# EAGLE design buffered multiple (EAGLE 7.7.0)
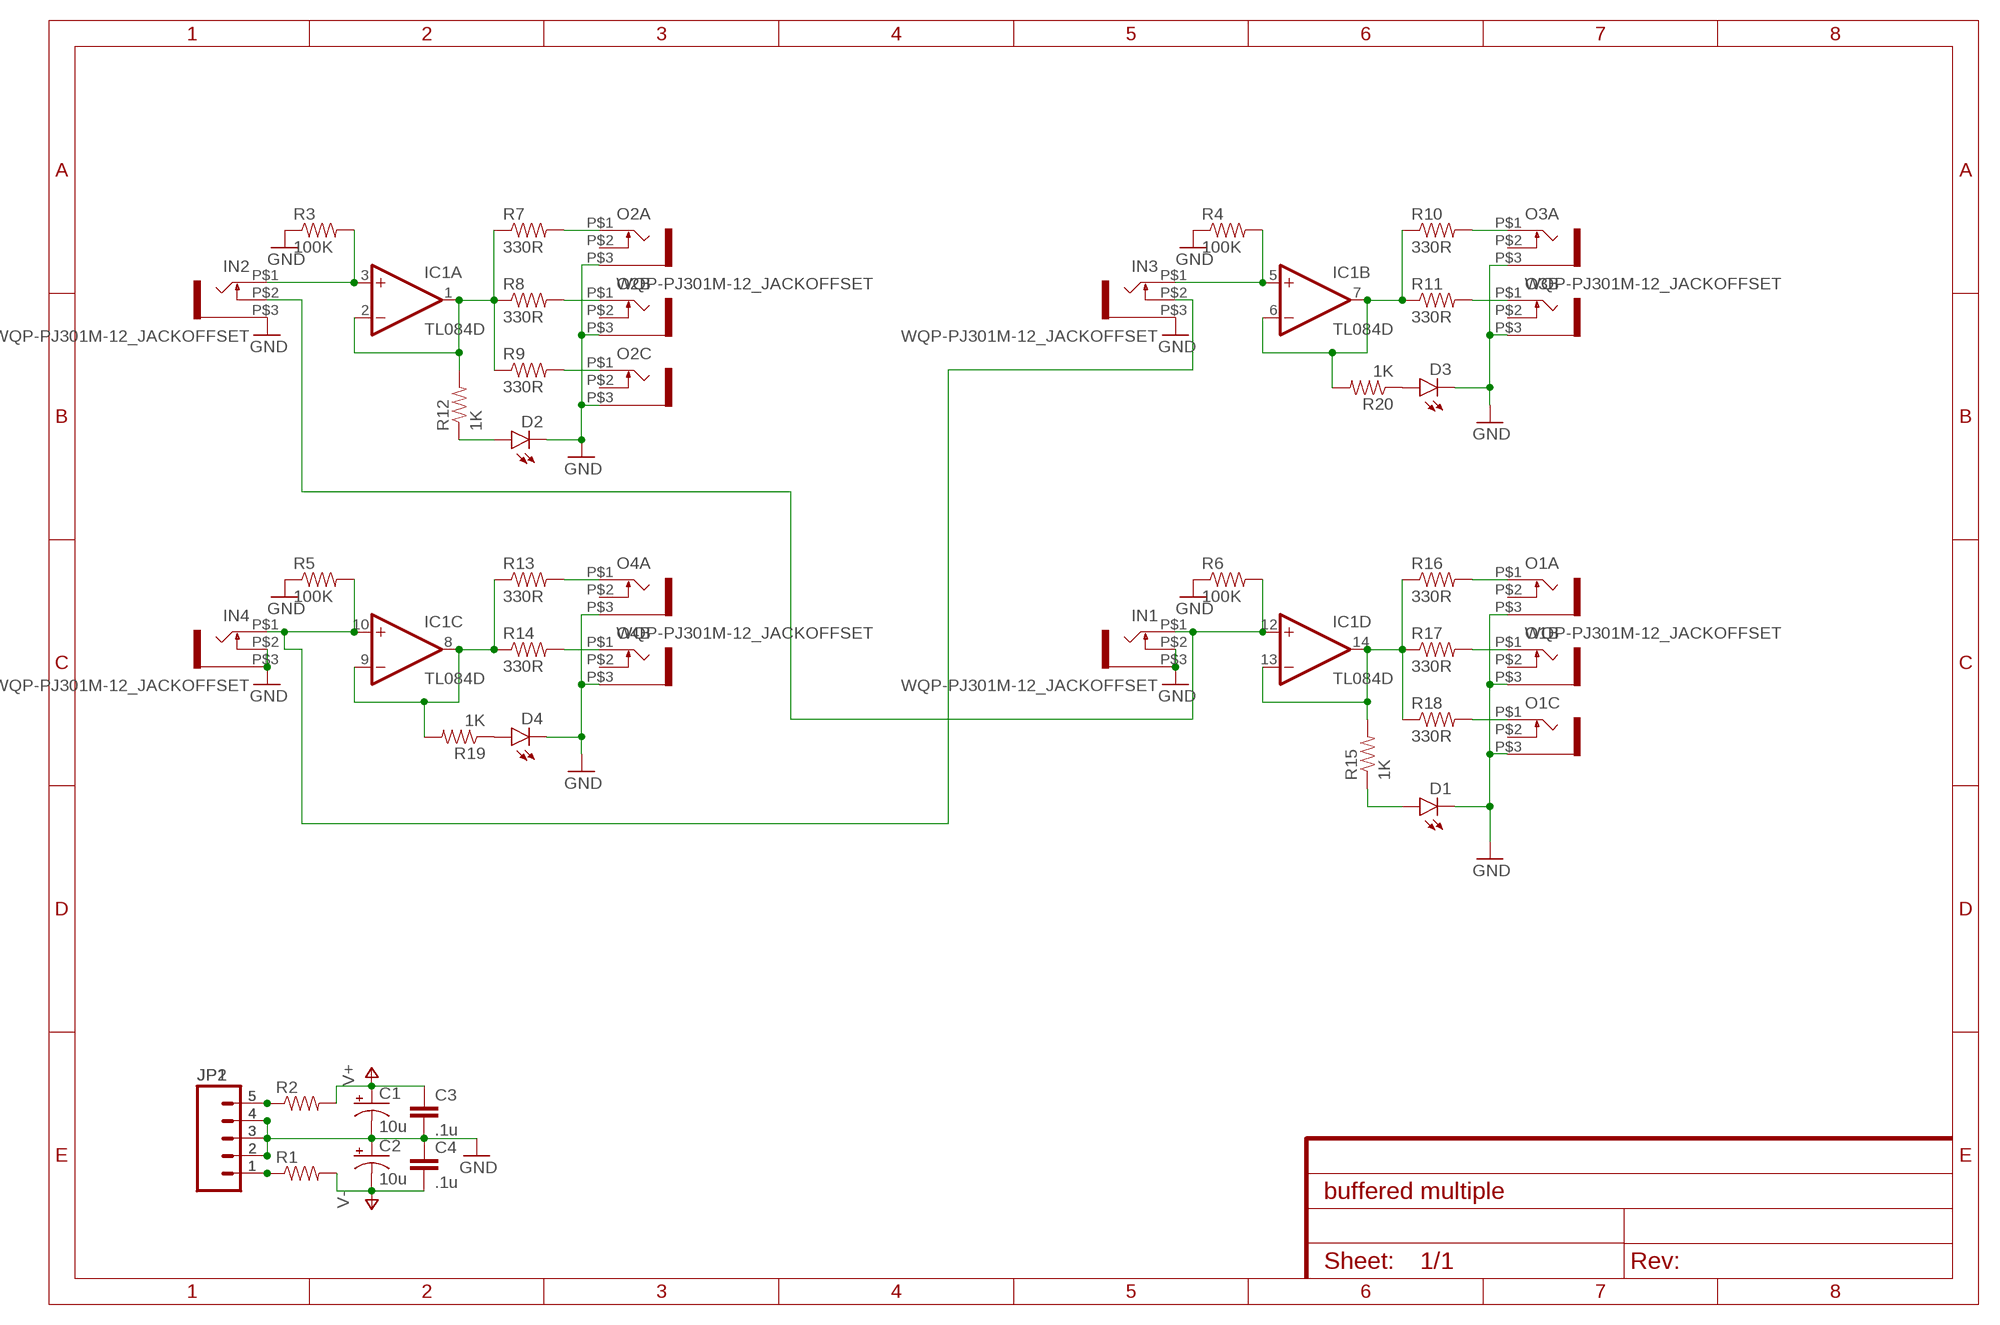
[diagram p0: schematic, sheet 1]

## Parts
C1  10u  CAP_POL1206-KIT  [EIA3216-KIT]
C2  10u  CAP_POL1206-KIT  [EIA3216-KIT]
C3  .1u  CAP0805  [0805]
C4  .1u  CAP0805  [0805]
D1  LED3MM  [LED3MM]
D2  LED3MM  [LED3MM]
D3  LED3MM  [LED3MM]
D4  LED3MM  [LED3MM]
IC1  TL084D  [SO14]
IN1  WQP-PJ301M-12_JACKOFFSET  [WQP-PJ301M-12_JACKOFFSET]
IN2  WQP-PJ301M-12_JACKOFFSET  [WQP-PJ301M-12_JACKOFFSET]
IN3  WQP-PJ301M-12_JACKOFFSET  [WQP-PJ301M-12_JACKOFFSET]
IN4  WQP-PJ301M-12_JACKOFFSET  [WQP-PJ301M-12_JACKOFFSET]
JP1  M05PTH  [1X05]
JP2  M05PTH  [1X05]
O1A  WQP-PJ301M-12_JACKOFFSET  [WQP-PJ301M-12_JACKOFFSET]
O1B  WQP-PJ301M-12_JACK  [WQP-PJ301M-12_JACK]
O1C  WQP-PJ301M-12_JACK  [WQP-PJ301M-12_JACK]
O2A  WQP-PJ301M-12_JACKOFFSET  [WQP-PJ301M-12_JACKOFFSET]
O2B  WQP-PJ301M-12_JACK  [WQP-PJ301M-12_JACK]
O2C  WQP-PJ301M-12_JACK  [WQP-PJ301M-12_JACK]
O3A  WQP-PJ301M-12_JACKOFFSET  [WQP-PJ301M-12_JACKOFFSET]
O3B  WQP-PJ301M-12_JACK  [WQP-PJ301M-12_JACK]
O4A  WQP-PJ301M-12_JACKOFFSET  [WQP-PJ301M-12_JACKOFFSET]
O4B  WQP-PJ301M-12_JACK  [WQP-PJ301M-12_JACK]
R1  RESISTOR0805-RES  [0805]
R2  RESISTOR0805-RES  [0805]
R3  100K  RESISTOR0805-RES  [0805]
R4  100K  RESISTOR0805-RES  [0805]
R5  100K  RESISTOR0805-RES  [0805]
R6  100K  RESISTOR0805-RES  [0805]
R7  330R  RESISTOR0805-RES  [0805]
R8  330R  RESISTOR0805-RES  [0805]
R9  330R  RESISTOR0805-RES  [0805]
R10  330R  RESISTOR0805-RES  [0805]
R11  330R  RESISTOR0805-RES  [0805]
R12  1K  RESISTOR0805-RES  [0805]
R13  330R  RESISTOR0805-RES  [0805]
R14  330R  RESISTOR0805-RES  [0805]
R15  1K  RESISTOR0805-RES  [0805]
R16  330R  RESISTOR0805-RES  [0805]
R17  330R  RESISTOR0805-RES  [0805]
R18  330R  RESISTOR0805-RES  [0805]
R19  1K  RESISTOR0805-RES  [0805]
R20  1K  RESISTOR0805-RES  [0805]

## Nets
GND: C1.C(-) C2.A(+) C3.2 C4.1 D1.K(C) D2.K(C) D3.K(C) D4.K(C) IN1.P$2 IN1.P$3 IN2.P$3 IN3.P$3 IN4.P$2 IN4.P$3 JP1.2 JP1.3 JP1.4 JP2.2 JP2.3 JP2.4 O1A.P$3 O1B.P$3 O1C.P$3 O2A.P$3 O2B.P$3 O2C.P$3 O3A.P$3 O3B.P$3 O4A.P$3 O4B.P$3 R3.1 R4.1 R5.1 R6.1
N$1: JP1.1 JP2.1 R1.1
N$2: JP1.5 JP2.5 R2.1
N$3: IC1.12(D:+IN) IN1.P$1 IN2.P$2 R6.2
N$4: IC1.10(C:+IN) IN3.P$2 IN4.P$1 R5.2
N$5: IC1.3(A:+IN) IN2.P$1 R3.2
N$6: IC1.5(B:+IN) IN3.P$1 R4.2
N$11: IC1.1(A:OUT) IC1.2(A:-IN) R7.1 R8.1 R9.1 R12.2
N$12: O2A.P$1 R7.2
N$13: O2B.P$1 R8.2
N$14: O2C.P$1 R9.2
N$16: IC1.8(C:OUT) IC1.9(C:-IN) R13.1 R14.1 R19.2
N$17: O4A.P$1 R13.2
N$18: O4B.P$1 R14.2
N$20: IC1.6(B:-IN) IC1.7(B:OUT) R10.1 R11.1 R20.2
N$21: O3A.P$1 R10.2
N$22: O3B.P$1 R11.2
N$23: D4.A R19.1
N$24: IC1.13(D:-IN) IC1.14(D:OUT) R15.2 R16.1 R17.1 R18.1
N$25: O1A.P$1 R16.2
N$26: O1B.P$1 R17.2
N$27: O1C.P$1 R18.2
N$28: D3.A R20.1
N$29: D1.A R15.1
N$30: D2.A R12.1
V+: C1.A(+) C3.1 R2.2
V-: C2.C(-) C4.2 R1.2
Unconnected: O1A.P$2 O1B.P$2 O1C.P$2 O2A.P$2 O2B.P$2 O2C.P$2 O3A.P$2 O3B.P$2 O4A.P$2 O4B.P$2

## Power pins joined to a net without a drawn wire
V+: IC1.4(P:V+)
V-: IC1.11(P:V-)

## Library data of the parts
C1 C2 = SparkFun-Capacitors:CAP_POL: Capacitor Polarized These are standard SMD and PTH capacitors. Normally 10uF, 47uF, and 100uF in electrolytic and tantalum varieties. Always verify the external diameter of the through hole cap, it varies with capacity, voltage, and manufacturer. The EIA devices should be standard.
C3 C4 = SparkFun-Passives:CAP: Capacitor Standard 0603 ceramic capacitor, and 0.1" leaded capacitor.
D1-D4 = SparkFun-LED:LED: LEDs Standard schematic elements and footprints for 5mm, 3mm, 1206, and 0603 sized LEDs. 5mm - Spark Fun Electronics SKU : COM-00529 (and others)
IC1 = linear:TL084: OP AMP
IN1-IN4 O1A O2A O3A O4A = thonkiconn:WQP-PJ301M-12_JACKOFFSET
JP1 JP2 = SparkFun-Connectors:M05: Header 5 Standard 5-pin 0.1" header. Use with straight break away headers (SKU : PRT-00116), right angle break away headers (PRT-00553), swiss pins (PRT-00743), machine pins (PRT-00117), and female headers (PRT-00115). Molex polarized connector foot print use with SKU : PRT-08230 with associated crimp pins and housings.
O1B O1C O2B O2C O3B O4B = thonkiconn:WQP-PJ301M-12_JACK
R1-R20 = SparkFun-Passives:RESISTOR: Resistor Basic schematic elements and footprints for 0603, 1206, and PTH resistors.

## Board
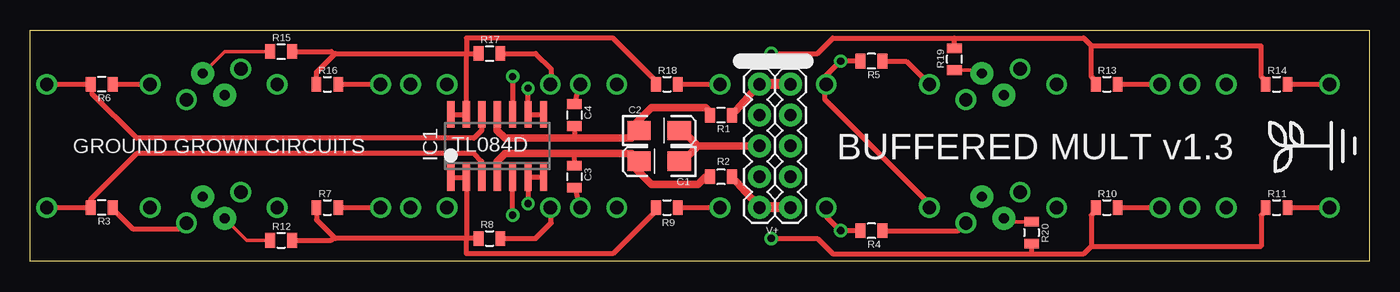
[diagram p1: board, top side]
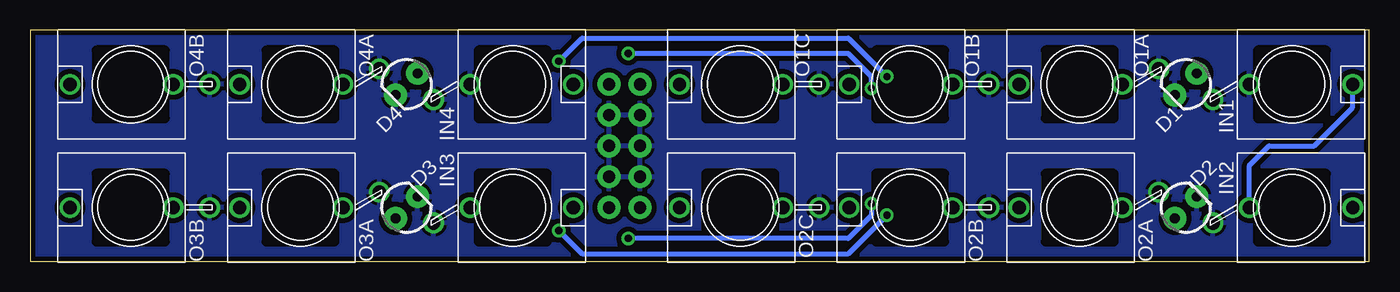
[diagram p2: board, bottom side, seen from below]

Size 110.17 x 19.05 mm. Coordinates in mm from the lower left corner, seen from the top.
Outline: 0,0 0,19.05 110.17,19.05 110.17,0 0,0
Copper layers (1*16): Top 0.035mm / dielectric 1.5mm / Bottom 0.035mm
Design rules "SparkFun": minimum track width 8mil, minimum drill 20mil, track to track 8mil, track to pad 8mil, pad to pad 8mil, via to via 8mil, smd to smd 8mil, copper to edge 8mil, drill to drill 8mil, minimum pad ring 12mil, minimum via ring 10mil, stop-mask expansion 4mil, vias tented up to drill 20mil, thermal gap 10mil

### Footprints (pad centres in the part's own frame; a part is rotated, then mirrored left to right if it is on the bottom)
EIA3216-KIT = smd 1.9 x 1.6: A 1.65,0; C -1.65,0
0805 = smd 0.8 x 1.2: 1 -0.9,0; 2 0.9,0
LED3MM = drill 0.813 pad 1.88: A -1.27,0; K 1.27,0
SO14 = smd 0.6 x 2.2: 1 -3.81,-2.6; 2 -2.54,-2.6; 3 -1.27,-2.6; 4 0,-2.6; 5 1.27,-2.6; 6 2.54,-2.6; 7 3.81,-2.6; 8 3.81,2.6; 9 2.54,2.6; 10 1.27,2.6; 11 0,2.6; 12 -1.27,2.6; 13 -2.54,2.6; 14 -3.81,2.6
WQP-PJ301M-12_JACKOFFSET = drill 1.1: P$1 0,5; P$2 0,-3.5; P$3 1.27,-6.5
1X05 = drill 1.016 pad 1.88: 1 0,0; 2 2.54,0; 3 5.08,0; 4 7.62,0; 5 10.16,0
WQP-PJ301M-12_JACK = drill 1.1: P$1 0,5; P$2 0,-3.5; P$3 0,-6.5

### Placement (x,y rotation side)
C1  51.75,8.26 180 top
C2  51.75,10.79 0 top
C3  44.77,6.99 270 top
C4  44.77,12.06 270 top
D1  15.08,14.61 225 bottom
D2  15.08,4.45 45 bottom
D3  79.22,4.45 45 bottom
D4  79.22,14.61 225 bottom
IC1  38.42,9.53 0 top
IN1  6.35,14.61 270 bottom
IN2  6.35,4.45 270 bottom
IN3  70.48,4.45 270 bottom
IN4  70.48,14.61 270 bottom
JP1  60.01,14.61 270 top
JP2  62.55,14.61 270 top
O1A  23.81,14.61 90 bottom
O1B  37.78,14.61 90 bottom
O1C  51.75,14.61 90 bottom
O2A  23.81,4.45 90 bottom
O2B  37.78,4.45 90 bottom
O2C  51.75,4.45 90 bottom
O3A  87.95,4.45 90 bottom
O3B  101.92,4.45 90 bottom
O4A  87.95,14.61 90 bottom
O4B  101.92,14.61 90 bottom
R1  56.83,12.06 180 top
R2  56.83,6.99 180 top
R3  5.87,4.45 180 top
R4  69.22,2.54 180 top
R5  69.22,16.51 180 top
R6  5.87,14.61 180 top
R7  24.45,4.45 0 top
R8  37.78,1.91 0 top
R9  52.39,4.45 0 top
R10  88.58,4.45 0 top
R11  102.55,4.45 0 top
R12  20.64,1.75 0 top
R13  88.58,14.61 0 top
R14  102.55,14.61 0 top
R15  20.64,17.3 0 top
R16  24.45,14.61 0 top
R17  37.78,17.14 0 top
R18  52.39,14.61 0 top
R19  76.04,16.67 90 top
R20  82.39,2.38 270 top
U$1  [LOGO_SMALL]  107,9.53 90 top

### Tracks (layer width: path | path; a pad name or v marks a point on that pad's centre or on a via)
GND
  Top 0.406: C4.1 O1C.P$3 | C3.2 O2C.P$3 | R5.1 72.08,16.51 IN4.P$2 | R4.1 76.35,2.54 IN3.P$3 | R6.1 IN1.P$2 | R3.1 6.77,4.34 8.41,2.7 12.37,2.7 IN2.P$3
  Top 0.61: C2.A 53.66,10.79 54.93,9.53 | C1.C 53.66,8.26 54.93,9.53 | 54.93,9.53 JP1.3
  pour Bottom (isolate 0.406): 0,0 0,19.05 110.17,19.05 110.17,0
N$1
  Top 0.61: JP1.1 R1.1
  Top 0.813: JP2.1 JP1.1
N$2
  Top 0.61: JP1.5 R2.1
  Top 0.813: JP2.5 JP1.5
N$3
  Top 0.406: IC1.12 37.15,10.79 36.51,10.16 8.73,10.16 5.08,13.81 5.08,14.55 R6.2 IN1.P$1
  Bottom 0.406: IN2.P$2 9.85,7.93 8.26,9.53 4.53,9.53 1.35,12.7 IN1.P$1
N$4  (via drill 0.6)
  Top 0.406: R5.2 v66.67,16.51 65.48,15.32 IN4.P$1 65.41,14.53 65.41,13.34 73.98,4.75 IN3.P$2 | v39.69,15.24 IC1.10
  Bottom 0.406: v66.67,16.51 64.77,18.41 42.86,18.41 v39.69,15.24
N$5
  Top 0.406: IC1.3 37.15,8.26 36.51,8.89 8.73,8.89 4.97,5.13 R3.2 IN2.P$1
N$6  (via drill 0.6)
  Top 0.406: R4.2 v66.67,2.54 65.48,3.73 IN3.P$1 | v39.69,3.81 IC1.5
  Bottom 0.406: v66.67,2.54 64.77,0.64 42.86,0.64 v39.69,3.81
N$11
  Top 0.406: 35.88,1.91 IC1.2 IC1.1 | R8.1 35.88,1.91 | 35.88,1.91 25.08,1.91 25,1.98 | 25,1.98 23.55,3.44 R7.1 | R9.1 51.49,4.18 47.94,0.64 35.88,0.64 35.88,1.91 | R12.2 24.77,1.75 25,1.98
N$12
  Top 0.406: R7.2 O2A.P$1
N$13
  Top 0.406: R8.2 41.59,1.91 42.86,3.17 42.86,4.37 O2B.P$1
N$14
  Top 0.406: R9.2 O2C.P$1
N$16  (via drill 0.6)
  Top 0.406: R13.1 87.68,14.87 87.31,15.24 87.31,17.78 | R14.1 101.65,14.87 101.28,15.24 101.28,17.78 87.31,17.78 | v40.96,14.29 IC1.9 IC1.8 | v60.96,17.14 64.77,17.14 66.04,18.41 76.04,18.41 | 76.04,18.41 86.68,18.41 87.31,17.78 | R19.2 76.04,18.41
  Bottom 0.406: v40.96,14.29 40.96,15.24 42.86,17.14 v60.96,17.14
N$17
  Top 0.406: R13.2 O4A.P$1
N$18
  Top 0.406: R14.2 O4B.P$1
N$20  (via drill 0.6)
  Top 0.406: R10.1 87.68,4.18 87.31,3.81 87.31,1.27 | 87.31,1.27 101.28,1.27 101.28,3.81 101.65,4.18 R11.1 | v40.96,4.76 IC1.6 IC1.7 | v60.96,1.91 64.77,1.91 66.04,0.64 82.39,0.64 | 82.39,0.64 86.68,0.64 87.31,1.27 | R20.2 82.39,0.64
  Bottom 0.406: v40.96,4.76 40.96,3.81 42.86,1.91 v60.96,1.91
N$21
  Top 0.406: R10.2 O3A.P$1
N$22
  Top 0.406: R11.2 O3B.P$1
N$23
  Top 0.305: R19.1 78.05,15.77 D4.A
N$24
  Top 0.406: R16.1 23.55,15.61 25,17.07 | 25,17.07 25.08,17.14 35.88,17.14 | 35.88,17.14 R17.1 | 35.88,17.14 IC1.13 IC1.14 | R18.1 51.49,14.87 47.94,18.41 35.88,18.41 35.88,17.14 | R15.2 24.77,17.3 25,17.07
N$25
  Top 0.406: R16.2 O1A.P$1
N$26
  Top 0.406: R17.2 41.59,17.14 42.86,15.88 42.86,14.69 O1B.P$1
N$27
  Top 0.406: R18.2 O1C.P$1
N$28
  Top 0.305: R20.1 80.38,3.28 D3.A
N$29
  Top 0.305: R15.1 15.98,17.3 D1.A
N$30
  Top 0.305: R12.1 17.78,1.75 D2.A
V+
  Top 0.406: C3.1 44.77,8.89
  Top 0.61: IC1.4 38.42,8.26 39.05,8.89 44.77,8.89 49.47,8.89 C1.A 49.85,8 49.85,7.62 51.12,6.35 54.93,6.35 55.56,6.99 R2.2
V-
  Top 0.406: C4.2 44.77,10.16 | 38.42,11.43 IC1.11
  Top 0.61: 38.42,11.43 38.42,10.79 39.05,10.16 44.77,10.16 49.47,10.16 C2.C 49.85,11.05 49.85,11.43 51.12,12.7 55.56,12.7 55.93,12.33 R1.2

### Text on the board
tPlace: GROUND GROWN CIRCUITS | BUFFERED MULT v1.3 | V+